# Altium schematic sheet 1_TOP.SchDoc: SmartHalo - Top level
size B; Author: Sébastien Gélinas; Organization: SmartHalo; Address1: 5445 de Gaspé; Address2: Montréal, QC; Address3: Canada; Address4: H2T 3B2; DocumentNumber: 1; Revision: 1; SheetNumber: 1; SheetTotal: 8
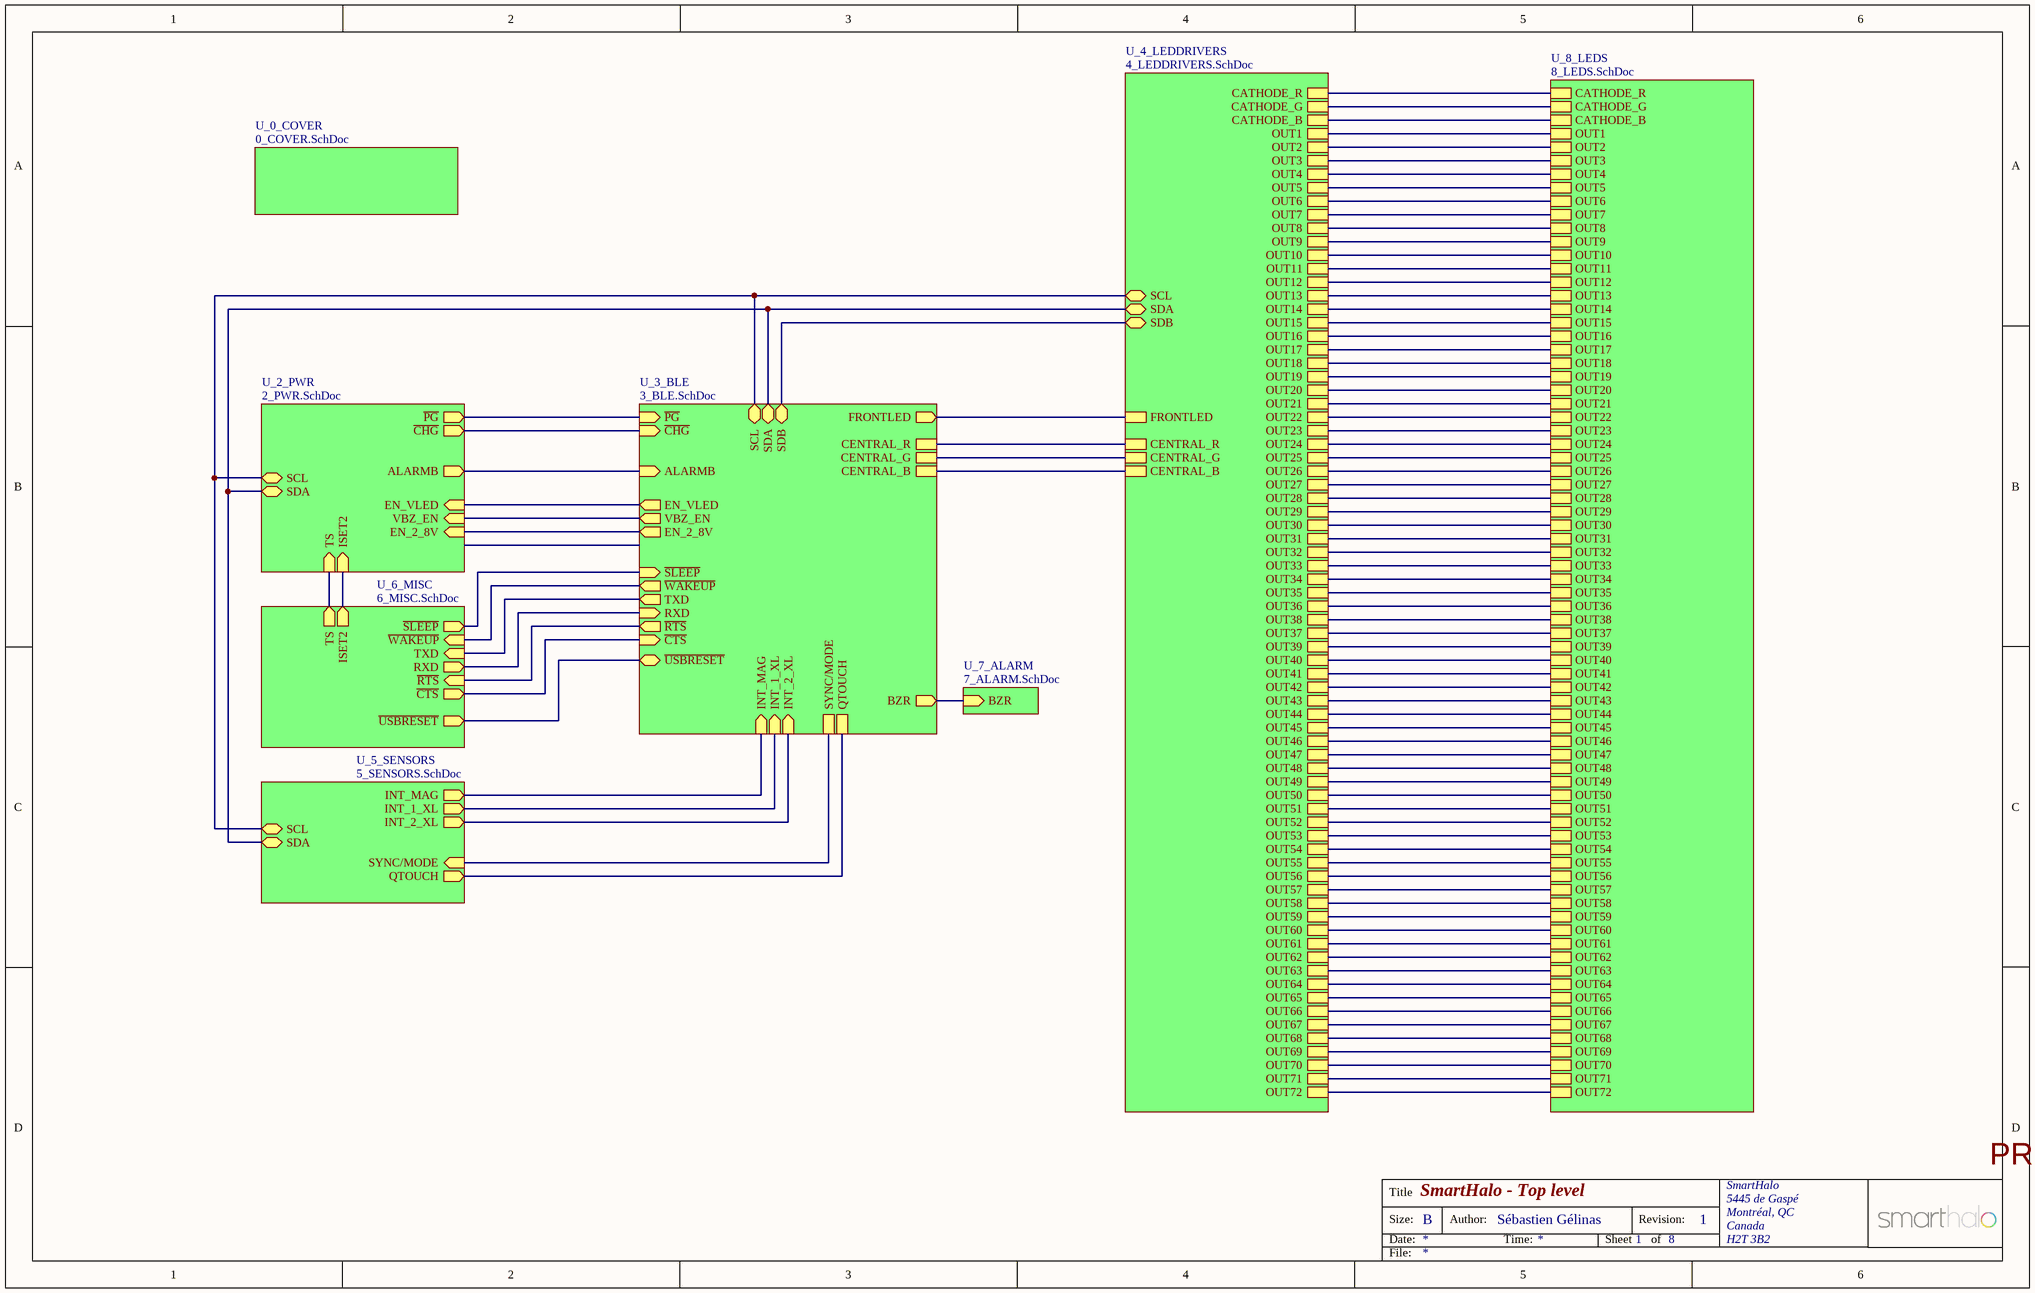
[diagram p0: 1_TOP.SchDoc]

## Sub-sheets
U_0_COVER = 0_COVER.SchDoc: no entries
U_2_PWR = 2_PWR.SchDoc: VBZ_EN (in), ISET2 (in), ~{PG} (out), ~{CHG} (out), EN_VLED (in), EN_2_8V (in), SCL (bidir), SDA (bidir), ALARMB (out), TS (in)
U_3_BLE = 3_BLE.SchDoc: SDA (bidir), SDB (bidir), BZR (out), FRONTLED (out), SCL (bidir), VBZ_EN (out), ~{CHG} (in), ~{PG} (in), ~{WAKEUP} (out), EN_VLED (out), EN_2_8V (out), QTOUCH, ALARMB (in), CENTRAL_R, CENTRAL_G, CENTRAL_B, INT_MAG (in), INT_1_XL (in), INT_2_XL (in), SYNC/MODE, ~{SLEEP} (in), RXD (in), TXD (out), ~{CTS} (in), ~{RTS} (out), ~{USBRESET}
U_4_LEDDRIVERS = 4_LEDDRIVERS.SchDoc: FRONTLED, SDA (bidir), SDB (bidir), SCL (bidir), CATHODE_B, CATHODE_G, CATHODE_R, OUT1, OUT2, OUT3, OUT4, OUT5, OUT6, OUT7, OUT8, OUT9, OUT10, OUT11, OUT12, OUT13, OUT14, OUT15, OUT16, OUT17, OUT18, OUT19, OUT20, OUT21, OUT22, OUT23, OUT24, OUT25, OUT26, OUT27, OUT28, OUT29, OUT30, OUT31, OUT32, OUT33, OUT34, OUT35, OUT36, OUT38, OUT37, OUT39, OUT40, OUT41, OUT42, OUT43, OUT44, OUT45, OUT46, OUT47, OUT48, OUT49, OUT50, OUT51, OUT52, OUT53, OUT54, OUT55, OUT56, OUT57, OUT58, OUT59, OUT60, OUT61, OUT62, OUT63, OUT64, OUT65, OUT66, OUT67, OUT69, OUT70, OUT71, OUT72, OUT68, CENTRAL_R, CENTRAL_G, CENTRAL_B
U_5_SENSORS = 5_SENSORS.SchDoc: SCL (bidir), SDA (bidir), INT_MAG (out), INT_2_XL (out), QTOUCH (out), SYNC/MODE (in), INT_1_XL (out)
U_6_MISC = 6_MISC.SchDoc: TXD (in), RXD (out), ~{WAKEUP} (in), ~{CTS} (out), ~{RTS} (in), ISET2 (out), TS (out), ~{USBRESET} (out), ~{SLEEP} (out)
U_7_ALARM = 7_ALARM.SchDoc: BZR (in)
U_8_LEDS = 8_LEDS.SchDoc: CATHODE_B, CATHODE_G, CATHODE_R, OUT1, OUT2, OUT3, OUT4, OUT5, OUT6, OUT7, OUT8, OUT9, OUT10, OUT11, OUT12, OUT13, OUT14, OUT15, OUT16, OUT17, OUT18, OUT19, OUT20, OUT21, OUT22, OUT23, OUT24, OUT25, OUT26, OUT27, OUT28, OUT29, OUT30, OUT31, OUT32, OUT33, OUT34, OUT35, OUT36, OUT38, OUT37, OUT39, OUT40, OUT41, OUT42, OUT43, OUT44, OUT45, OUT46, OUT47, OUT48, OUT49, OUT50, OUT51, OUT52, OUT53, OUT54, OUT55, OUT56, OUT57, OUT58, OUT59, OUT60, OUT61, OUT62, OUT63, OUT64, OUT65, OUT66, OUT67, OUT69, OUT70, OUT71, OUT72, OUT68

## Nets
(unnamed): sheet U_2_PWR/VBZ_EN, sheet U_3_BLE/VBZ_EN
(unnamed): sheet U_2_PWR/ISET2, sheet U_6_MISC/ISET2
(unnamed): sheet U_2_PWR/~{PG}, sheet U_3_BLE/~{PG}
(unnamed): sheet U_2_PWR/~{CHG}, sheet U_3_BLE/~{CHG}
(unnamed): sheet U_2_PWR/EN_VLED, sheet U_3_BLE/EN_VLED
(unnamed): sheet U_2_PWR/EN_2_8V, sheet U_3_BLE/EN_2_8V
(unnamed): sheet U_2_PWR/SCL, sheet U_3_BLE/SCL, sheet U_4_LEDDRIVERS/SCL, sheet U_5_SENSORS/SCL
(unnamed): sheet U_2_PWR/SDA, sheet U_3_BLE/SDA, sheet U_4_LEDDRIVERS/SDA, sheet U_5_SENSORS/SDA
(unnamed): sheet U_2_PWR/ALARMB, sheet U_3_BLE/ALARMB
(unnamed): sheet U_2_PWR/TS, sheet U_6_MISC/TS
(unnamed): sheet U_3_BLE/SDB, sheet U_4_LEDDRIVERS/SDB
(unnamed): sheet U_3_BLE/BZR, sheet U_7_ALARM/BZR
(unnamed): sheet U_3_BLE/FRONTLED, sheet U_4_LEDDRIVERS/FRONTLED
(unnamed): sheet U_3_BLE/~{WAKEUP}, sheet U_6_MISC/~{WAKEUP}
(unnamed): sheet U_3_BLE/QTOUCH, sheet U_5_SENSORS/QTOUCH
(unnamed): sheet U_3_BLE/CENTRAL_R, sheet U_4_LEDDRIVERS/CENTRAL_R
(unnamed): sheet U_3_BLE/CENTRAL_G, sheet U_4_LEDDRIVERS/CENTRAL_G
(unnamed): sheet U_3_BLE/CENTRAL_B, sheet U_4_LEDDRIVERS/CENTRAL_B
(unnamed): sheet U_3_BLE/INT_MAG, sheet U_5_SENSORS/INT_MAG
(unnamed): sheet U_3_BLE/INT_1_XL, sheet U_5_SENSORS/INT_1_XL
(unnamed): sheet U_3_BLE/INT_2_XL, sheet U_5_SENSORS/INT_2_XL
(unnamed): sheet U_3_BLE/SYNC/MODE, sheet U_5_SENSORS/SYNC/MODE
(unnamed): sheet U_3_BLE/~{SLEEP}, sheet U_6_MISC/~{SLEEP}
(unnamed): sheet U_3_BLE/RXD, sheet U_6_MISC/RXD
(unnamed): sheet U_3_BLE/TXD, sheet U_6_MISC/TXD
(unnamed): sheet U_3_BLE/~{CTS}, sheet U_6_MISC/~{CTS}
(unnamed): sheet U_3_BLE/~{RTS}, sheet U_6_MISC/~{RTS}
(unnamed): sheet U_3_BLE/~{USBRESET}, sheet U_6_MISC/~{USBRESET}
(unnamed): sheet U_4_LEDDRIVERS/CATHODE_B, sheet U_8_LEDS/CATHODE_B
(unnamed): sheet U_4_LEDDRIVERS/CATHODE_G, sheet U_8_LEDS/CATHODE_G
(unnamed): sheet U_4_LEDDRIVERS/CATHODE_R, sheet U_8_LEDS/CATHODE_R
(unnamed): sheet U_4_LEDDRIVERS/OUT1, sheet U_8_LEDS/OUT1
(unnamed): sheet U_4_LEDDRIVERS/OUT2, sheet U_8_LEDS/OUT2
(unnamed): sheet U_4_LEDDRIVERS/OUT3, sheet U_8_LEDS/OUT3
(unnamed): sheet U_4_LEDDRIVERS/OUT4, sheet U_8_LEDS/OUT4
(unnamed): sheet U_4_LEDDRIVERS/OUT5, sheet U_8_LEDS/OUT5
(unnamed): sheet U_4_LEDDRIVERS/OUT6, sheet U_8_LEDS/OUT6
(unnamed): sheet U_4_LEDDRIVERS/OUT7, sheet U_8_LEDS/OUT7
(unnamed): sheet U_4_LEDDRIVERS/OUT8, sheet U_8_LEDS/OUT8
(unnamed): sheet U_4_LEDDRIVERS/OUT9, sheet U_8_LEDS/OUT9
(unnamed): sheet U_4_LEDDRIVERS/OUT10, sheet U_8_LEDS/OUT10
(unnamed): sheet U_4_LEDDRIVERS/OUT11, sheet U_8_LEDS/OUT11
(unnamed): sheet U_4_LEDDRIVERS/OUT12, sheet U_8_LEDS/OUT12
(unnamed): sheet U_4_LEDDRIVERS/OUT13, sheet U_8_LEDS/OUT13
(unnamed): sheet U_4_LEDDRIVERS/OUT14, sheet U_8_LEDS/OUT14
(unnamed): sheet U_4_LEDDRIVERS/OUT15, sheet U_8_LEDS/OUT15
(unnamed): sheet U_4_LEDDRIVERS/OUT16, sheet U_8_LEDS/OUT16
(unnamed): sheet U_4_LEDDRIVERS/OUT17, sheet U_8_LEDS/OUT17
(unnamed): sheet U_4_LEDDRIVERS/OUT18, sheet U_8_LEDS/OUT18
(unnamed): sheet U_4_LEDDRIVERS/OUT19, sheet U_8_LEDS/OUT19
(unnamed): sheet U_4_LEDDRIVERS/OUT20, sheet U_8_LEDS/OUT20
(unnamed): sheet U_4_LEDDRIVERS/OUT21, sheet U_8_LEDS/OUT21
(unnamed): sheet U_4_LEDDRIVERS/OUT22, sheet U_8_LEDS/OUT22
(unnamed): sheet U_4_LEDDRIVERS/OUT23, sheet U_8_LEDS/OUT23
(unnamed): sheet U_4_LEDDRIVERS/OUT24, sheet U_8_LEDS/OUT24
(unnamed): sheet U_4_LEDDRIVERS/OUT25, sheet U_8_LEDS/OUT25
(unnamed): sheet U_4_LEDDRIVERS/OUT26, sheet U_8_LEDS/OUT26
(unnamed): sheet U_4_LEDDRIVERS/OUT27, sheet U_8_LEDS/OUT27
(unnamed): sheet U_4_LEDDRIVERS/OUT28, sheet U_8_LEDS/OUT28
(unnamed): sheet U_4_LEDDRIVERS/OUT29, sheet U_8_LEDS/OUT29
(unnamed): sheet U_4_LEDDRIVERS/OUT30, sheet U_8_LEDS/OUT30
(unnamed): sheet U_4_LEDDRIVERS/OUT31, sheet U_8_LEDS/OUT31
(unnamed): sheet U_4_LEDDRIVERS/OUT32, sheet U_8_LEDS/OUT32
(unnamed): sheet U_4_LEDDRIVERS/OUT33, sheet U_8_LEDS/OUT33
(unnamed): sheet U_4_LEDDRIVERS/OUT34, sheet U_8_LEDS/OUT34
(unnamed): sheet U_4_LEDDRIVERS/OUT35, sheet U_8_LEDS/OUT35
(unnamed): sheet U_4_LEDDRIVERS/OUT36, sheet U_8_LEDS/OUT36
(unnamed): sheet U_4_LEDDRIVERS/OUT38, sheet U_8_LEDS/OUT38
(unnamed): sheet U_4_LEDDRIVERS/OUT37, sheet U_8_LEDS/OUT37
(unnamed): sheet U_4_LEDDRIVERS/OUT39, sheet U_8_LEDS/OUT39
(unnamed): sheet U_4_LEDDRIVERS/OUT40, sheet U_8_LEDS/OUT40
(unnamed): sheet U_4_LEDDRIVERS/OUT41, sheet U_8_LEDS/OUT41
(unnamed): sheet U_4_LEDDRIVERS/OUT42, sheet U_8_LEDS/OUT42
(unnamed): sheet U_4_LEDDRIVERS/OUT43, sheet U_8_LEDS/OUT43
(unnamed): sheet U_4_LEDDRIVERS/OUT44, sheet U_8_LEDS/OUT44
(unnamed): sheet U_4_LEDDRIVERS/OUT45, sheet U_8_LEDS/OUT45
(unnamed): sheet U_4_LEDDRIVERS/OUT46, sheet U_8_LEDS/OUT46
(unnamed): sheet U_4_LEDDRIVERS/OUT47, sheet U_8_LEDS/OUT47
(unnamed): sheet U_4_LEDDRIVERS/OUT48, sheet U_8_LEDS/OUT48
(unnamed): sheet U_4_LEDDRIVERS/OUT49, sheet U_8_LEDS/OUT49
(unnamed): sheet U_4_LEDDRIVERS/OUT50, sheet U_8_LEDS/OUT50
(unnamed): sheet U_4_LEDDRIVERS/OUT51, sheet U_8_LEDS/OUT51
(unnamed): sheet U_4_LEDDRIVERS/OUT52, sheet U_8_LEDS/OUT52
(unnamed): sheet U_4_LEDDRIVERS/OUT53, sheet U_8_LEDS/OUT53
(unnamed): sheet U_4_LEDDRIVERS/OUT54, sheet U_8_LEDS/OUT54
(unnamed): sheet U_4_LEDDRIVERS/OUT55, sheet U_8_LEDS/OUT55
(unnamed): sheet U_4_LEDDRIVERS/OUT56, sheet U_8_LEDS/OUT56
(unnamed): sheet U_4_LEDDRIVERS/OUT57, sheet U_8_LEDS/OUT57
(unnamed): sheet U_4_LEDDRIVERS/OUT58, sheet U_8_LEDS/OUT58
(unnamed): sheet U_4_LEDDRIVERS/OUT59, sheet U_8_LEDS/OUT59
(unnamed): sheet U_4_LEDDRIVERS/OUT60, sheet U_8_LEDS/OUT60
(unnamed): sheet U_4_LEDDRIVERS/OUT61, sheet U_8_LEDS/OUT61
(unnamed): sheet U_4_LEDDRIVERS/OUT62, sheet U_8_LEDS/OUT62
(unnamed): sheet U_4_LEDDRIVERS/OUT63, sheet U_8_LEDS/OUT63
(unnamed): sheet U_4_LEDDRIVERS/OUT64, sheet U_8_LEDS/OUT64
(unnamed): sheet U_4_LEDDRIVERS/OUT65, sheet U_8_LEDS/OUT65
(unnamed): sheet U_4_LEDDRIVERS/OUT66, sheet U_8_LEDS/OUT66
(unnamed): sheet U_4_LEDDRIVERS/OUT67, sheet U_8_LEDS/OUT67
(unnamed): sheet U_4_LEDDRIVERS/OUT69, sheet U_8_LEDS/OUT69
(unnamed): sheet U_4_LEDDRIVERS/OUT70, sheet U_8_LEDS/OUT70
(unnamed): sheet U_4_LEDDRIVERS/OUT71, sheet U_8_LEDS/OUT71
(unnamed): sheet U_4_LEDDRIVERS/OUT72, sheet U_8_LEDS/OUT72
(unnamed): sheet U_4_LEDDRIVERS/OUT68, sheet U_8_LEDS/OUT68

## Notes on the sheet
- PRELIMINARY: DO NOT USE FOR PRODUCTION
- Title
- Size:
- Date:
- B
- Author:
- Time:
- Sheet
- Revision:
- of
- File: